# Altium schematic sheet SAMC21_Xplained_Pro_TopLevel.SchDoc: Top Level Schematics
size A3; Organization: ATMEL Norway; Address1: Vestre Rosten 79; Address2: N-7075 TILLER; Address3: NORWAY; DocumentNumber: A09-2419; Revision: 2; SheetNumber: 1; SheetTotal: 9; PageSetup: Record=PageOptions|CenterHorizontal=True|CenterVertical=True|PrintScale=1.01|XCorrection=1.00|YCorrection=1.00|PrintKind=1|BorderSize=5000000|LeftOffset=0|BottomOffset=0|Orientation=2|PaperLength=1000|PaperWidth=1000|Scale=100|PaperSource=7|PrintQuality=-4|MediaType=1|DitherType=10|PaperKind=Letter|PrintScaleMode=1
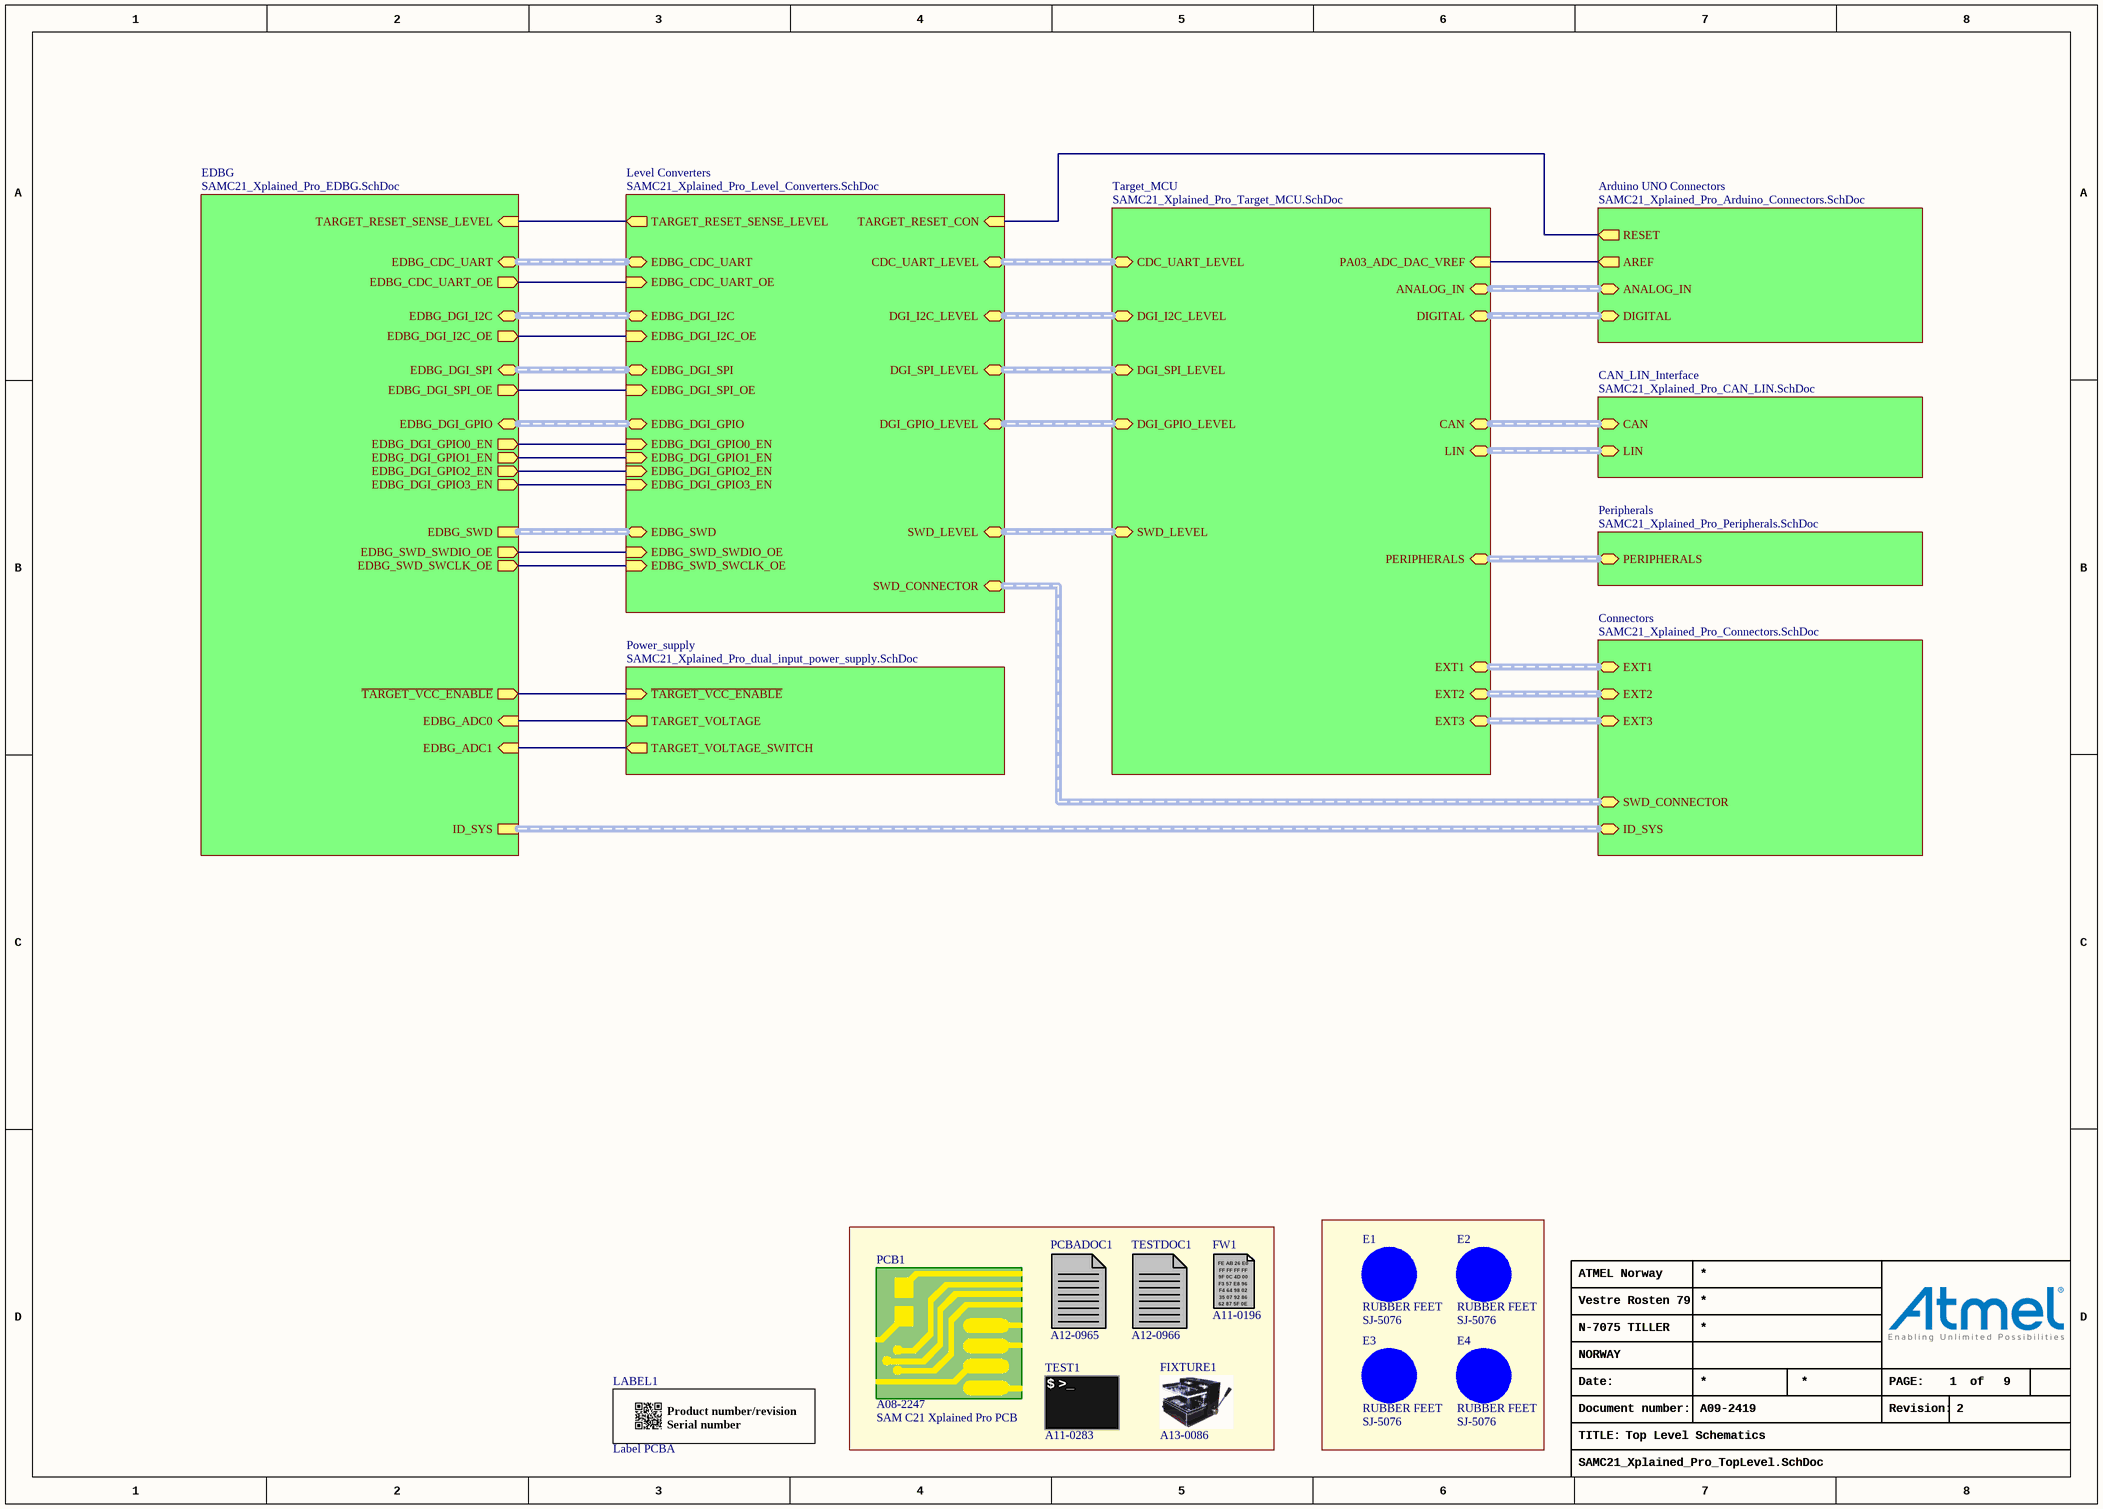
[diagram p0: SAMC21_Xplained_Pro_TopLevel.SchDoc]

## Parts
E1  RUBBER FEET  value SJ-5076  [AP8-00192]
E2  RUBBER FEET  value SJ-5076  [AP8-00192]
E3  RUBBER FEET  value SJ-5076  [AP8-00192]
E4  RUBBER FEET  value SJ-5076  [AP8-00192]
FIXTURE1  AN: A13-0086  (hidden comment: JIG)  (mechanical)
FW1  AN: A11-0196  (hidden comment: FW)  (mechanical)
LABEL1  value Label PCBA  [AP8-00317]  (hidden comment: PCBA_LABEL)
PCB1  value SAM C21 Xplained Pro PCB  AN: A08-2247  (hidden comment: PCB)  (mechanical)
PCBADOC1  AN: A12-0965  (hidden comment: PCBADOC)  (mechanical)
TEST1  AN: A11-0283  (hidden comment: TEST)  (mechanical)
TESTDOC1  AN: A12-0966  (hidden comment: TESTDOC)  (mechanical)

## Sub-sheets
Arduino UNO Connectors = SAMC21_Xplained_Pro_Arduino_Connectors.SchDoc: ANALOG_IN (harness ANALOG_IN), DIGITAL (harness DIGITAL1), RESET (out), AREF (out)
CAN_LIN_Interface = SAMC21_Xplained_Pro_CAN_LIN.SchDoc: CAN (harness CAN), LIN (harness LIN)
Connectors = SAMC21_Xplained_Pro_Connectors.SchDoc: ID_SYS (harness ID_SYS), EXT1 (harness EXT), EXT3 (harness EXT), EXT2 (harness EXT), SWD_CONNECTOR (harness SWD)
EDBG = SAMC21_Xplained_Pro_EDBG.SchDoc: ID_SYS (harness ID_SYS), EDBG_SWD (harness SWD), EDBG_CDC_UART (harness CDC_UART), EDBG_DGI_I2C (harness DGI_I2C), EDBG_DGI_SPI (harness DGI_SPI), EDBG_DGI_GPIO (harness DGI_GPIO), EDBG_ADC0 (in), ~{TARGET_VCC_ENABLE} (out), EDBG_CDC_UART_OE (out), EDBG_SWD_SWDIO_OE (out), EDBG_DGI_I2C_OE (out), EDBG_ADC1 (in), EDBG_SWD_SWCLK_OE (out), EDBG_DGI_SPI_OE (out), TARGET_RESET_SENSE_LEVEL (in), EDBG_DGI_GPIO0_EN (out), EDBG_DGI_GPIO1_EN (out), EDBG_DGI_GPIO2_EN (out), EDBG_DGI_GPIO3_EN (out)
Level Converters = SAMC21_Xplained_Pro_Level_Converters.SchDoc: EDBG_DGI_SPI (harness DGI_SPI), EDBG_DGI_I2C (harness DGI_I2C), EDBG_DGI_GPIO (harness DGI_GPIO), EDBG_CDC_UART (harness CDC_UART), EDBG_SWD (harness SWD), EDBG_SWD_SWDIO_OE (in), EDBG_SWD_SWCLK_OE (in), SWD_LEVEL (harness SWD), DGI_SPI_LEVEL (harness DGI_SPI), DGI_I2C_LEVEL (harness DGI_I2C), DGI_GPIO_LEVEL (harness DGI_GPIO), CDC_UART_LEVEL (harness CDC_UART), TARGET_RESET_SENSE_LEVEL (out), SWD_CONNECTOR (harness SWD), EDBG_DGI_GPIO0_EN (in), EDBG_DGI_GPIO1_EN (in), EDBG_DGI_GPIO2_EN (in), EDBG_DGI_GPIO3_EN (in), EDBG_CDC_UART_OE (in), EDBG_DGI_I2C_OE (in), EDBG_DGI_SPI_OE (in), TARGET_RESET_CON (in)
Peripherals = SAMC21_Xplained_Pro_Peripherals.SchDoc: PERIPHERALS (harness Peripherals)
Power_supply = SAMC21_Xplained_Pro_dual_input_power_supply.SchDoc: TARGET_VOLTAGE (out), ~{TARGET_VCC_ENABLE} (in), TARGET_VOLTAGE_SWITCH (out)
Target_MCU = SAMC21_Xplained_Pro_Target_MCU.SchDoc: SWD_LEVEL (harness SWD), DGI_SPI_LEVEL (harness DGI_SPI), DGI_I2C_LEVEL (harness DGI_I2C), DGI_GPIO_LEVEL (harness DGI_GPIO), CDC_UART_LEVEL (harness CDC_UART), EXT2 (harness EXT), EXT3 (harness EXT), EXT1 (harness EXT), CAN (harness CAN), LIN (harness LIN), DIGITAL (harness DIGITAL1), ANALOG_IN (harness ANALOG_IN), PA03_ADC_DAC_VREF (in), PERIPHERALS (harness Peripherals)

## Nets
(unnamed): sheet Target_MCU/PA03_ADC_DAC_VREF, sheet Arduino UNO Connectors/AREF
(unnamed): sheet EDBG/EDBG_ADC0, sheet Power_supply/TARGET_VOLTAGE
(unnamed): sheet EDBG/~{TARGET_VCC_ENABLE}, sheet Power_supply/~{TARGET_VCC_ENABLE}
(unnamed): sheet EDBG/EDBG_CDC_UART_OE, sheet Level Converters/EDBG_CDC_UART_OE
(unnamed): sheet EDBG/EDBG_SWD_SWDIO_OE, sheet Level Converters/EDBG_SWD_SWDIO_OE
(unnamed): sheet EDBG/EDBG_DGI_I2C_OE, sheet Level Converters/EDBG_DGI_I2C_OE
(unnamed): sheet EDBG/EDBG_ADC1, sheet Power_supply/TARGET_VOLTAGE_SWITCH
(unnamed): sheet EDBG/EDBG_SWD_SWCLK_OE, sheet Level Converters/EDBG_SWD_SWCLK_OE
(unnamed): sheet EDBG/EDBG_DGI_SPI_OE, sheet Level Converters/EDBG_DGI_SPI_OE
(unnamed): sheet EDBG/TARGET_RESET_SENSE_LEVEL, sheet Level Converters/TARGET_RESET_SENSE_LEVEL
(unnamed): sheet EDBG/EDBG_DGI_GPIO0_EN, sheet Level Converters/EDBG_DGI_GPIO0_EN
(unnamed): sheet EDBG/EDBG_DGI_GPIO1_EN, sheet Level Converters/EDBG_DGI_GPIO1_EN
(unnamed): sheet EDBG/EDBG_DGI_GPIO2_EN, sheet Level Converters/EDBG_DGI_GPIO2_EN
(unnamed): sheet EDBG/EDBG_DGI_GPIO3_EN, sheet Level Converters/EDBG_DGI_GPIO3_EN
(unnamed): sheet Arduino UNO Connectors/RESET, sheet Level Converters/TARGET_RESET_CON

Not connected (* = marked no-connect by the designer): E1 1(FIDUCIAL); E2 1(FIDUCIAL); E3 1(FIDUCIAL); E4 1(FIDUCIAL)

## Buses and harness runs
harness sheet Arduino UNO Connectors/ANALOG_IN = sheet Target_MCU/ANALOG_IN
harness sheet Arduino UNO Connectors/DIGITAL = sheet Target_MCU/DIGITAL
harness sheet CAN_LIN_Interface/CAN = sheet Target_MCU/CAN
harness sheet CAN_LIN_Interface/LIN = sheet Target_MCU/LIN
harness sheet Connectors/EXT1 = sheet Target_MCU/EXT1
harness sheet Connectors/EXT2 = sheet Target_MCU/EXT2
harness sheet Connectors/EXT3 = sheet Target_MCU/EXT3
harness sheet Connectors/ID_SYS = sheet EDBG/ID_SYS
harness sheet Connectors/SWD_CONNECTOR = sheet Level Converters/SWD_CONNECTOR
harness sheet EDBG/EDBG_CDC_UART = sheet Level Converters/EDBG_CDC_UART
harness sheet EDBG/EDBG_DGI_GPIO = sheet Level Converters/EDBG_DGI_GPIO
harness sheet EDBG/EDBG_DGI_I2C = sheet Level Converters/EDBG_DGI_I2C
harness sheet EDBG/EDBG_DGI_SPI = sheet Level Converters/EDBG_DGI_SPI
harness sheet EDBG/EDBG_SWD = sheet Level Converters/EDBG_SWD
harness sheet Level Converters/CDC_UART_LEVEL = sheet Target_MCU/CDC_UART_LEVEL
harness sheet Level Converters/DGI_GPIO_LEVEL = sheet Target_MCU/DGI_GPIO_LEVEL
harness sheet Level Converters/DGI_I2C_LEVEL = sheet Target_MCU/DGI_I2C_LEVEL
harness sheet Level Converters/DGI_SPI_LEVEL = sheet Target_MCU/DGI_SPI_LEVEL
harness sheet Level Converters/SWD_LEVEL = sheet Target_MCU/SWD_LEVEL
harness sheet Peripherals/PERIPHERALS = sheet Target_MCU/PERIPHERALS

## Notes on the sheet
- Date:
- PAGE:
- of
- TITLE:
- Document number:
- Revision:
- (in symbol A09-0611) / Product number/revision / Serial number
- (in symbol A11-0196) FE AB 26 E0; FF FF FF FF; 9F 0C 4D 00; F3 57 E8 96; F4 64 98 02; 35 07 92 86; 62 87 5F 0E
- (in symbol A11-0283) $ >_

## Library data of the parts
E1-E4 = A08-0053: 2.8mm adhesive feet,diam 8.0mm; PartGroup: Mechanical devices,Mounting accessories; Manufacturer: 3M; AN: A08-0053; Height: 2,79999995231628; MPN: SJ-5076
FIXTURE1 = A13-0086: Xplained PRO MCU board Jupiter Test Fixture; PartGroup: Test Equipment,Test Fixtures; Manufacturer: ESCATEC; Value: Xplained PRO MCU board Jupiter Test Fixture; MPN: Xplained PRO MCU board Jupiter Test Fixture
FW1 = A11-0196: EDBG secured firmware; PartGroup: Software,Firmware,Tools; Manufacturer: ATMEL; Value: EDBG secured firmware
LABEL1 = A09-0611: PCBA identification label PP Top White Gloss; PartGroup: Mechanical devices,Packaging materials,Printed Labels; Manufacturer: ACT Logimark AS; MPN: 505462; AN: A09-0611
PCB1 = A08-2247: SAM C21 Xplained Pro PCB, 4 layer, 60mm x 100mm; PartGroup: Mechanical devices,Printed circuit boards
PCBADOC1 = A12-0965: SAM C21 Xplained Pro PCBA documentation; PartGroup: Documentation,PCBA Documents,Atmel; Value: A09-2419 PCBA Files
TEST1 = A11-0283: Fixture eggTest for SAM C21 Xplained Pro; PartGroup: Software,Test software,Starter Kit; Value: SAM C21 Xplained Pro test
TESTDOC1 = A12-0966: SAM C21 Xplained Pro Test Instructions; PartGroup: Documentation,Procedures,Test Instructions; Value: SAM C21 Xplained Pro Test Instructions